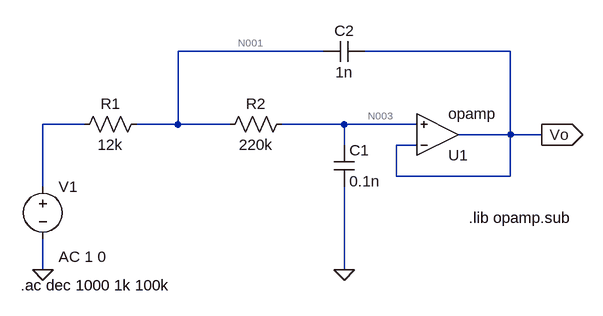
[diagram p0: schematic sallen-key.asc]
sallen-key.asc, the LTspice schematic file:
Version 4
SHEET 1 880 680
WIRE 368 16 144 16
WIRE 656 16 432 16
WIRE 0 128 -64 128
WIRE 144 128 144 16
WIRE 144 128 80 128
WIRE 224 128 144 128
WIRE 400 128 304 128
WIRE 512 128 400 128
WIRE 656 144 656 16
WIRE 656 144 576 144
WIRE 704 144 656 144
WIRE 400 160 400 128
WIRE 512 160 480 160
WIRE 480 208 480 160
WIRE 656 208 656 144
WIRE 656 208 480 208
WIRE -64 224 -64 128
WIRE -64 352 -64 304
WIRE 400 352 400 224
FLAG -64 352 0
FLAG 400 352 0
FLAG 704 144 Vo
IOPIN 704 144 Out
SYMBOL res 96 112 R90
WINDOW 0 0 56 VBottom 2
WINDOW 3 32 56 VTop 2
SYMATTR InstName R1
SYMATTR Value 12k
SYMBOL res 320 112 R90
WINDOW 0 0 56 VBottom 2
WINDOW 3 32 56 VTop 2
SYMATTR InstName R2
SYMATTR Value 220k
SYMBOL cap 384 160 R0
SYMATTR InstName C1
SYMATTR Value 0.1n
SYMBOL cap 432 0 R90
WINDOW 0 0 32 VBottom 2
WINDOW 3 32 32 VTop 2
SYMATTR InstName C2
SYMATTR Value 1n
SYMBOL voltage -64 208 R0
WINDOW 123 24 124 Left 2
WINDOW 39 0 0 Left 0
SYMATTR InstName V1
SYMATTR Value ""
SYMATTR Value2 AC 1 0
SYMBOL OpAmps\\opamp 544 208 M180
SYMATTR InstName U1
TEXT 592 272 Left 2 !.lib opamp.sub
TEXT -98 376 Left 2 !.ac dec 1000 1k 100k

The netlist it stands for:
* sallen-key.asc
R1 N001 N002 12k
R2 N003 N001 220k
C1 N003 0 0.1n
C2 Vo N001 1n
V1 N002 0 AC 1 0
XU1 Vo N003 Vo opamp Aol=100K GBW=10Meg  ; pins invin noninvin out
.lib opamp.sub
.ac dec 1000 1k 100k
.backanno
.end

* Results of the author's LTspice run, read from the files saved beside the schematic
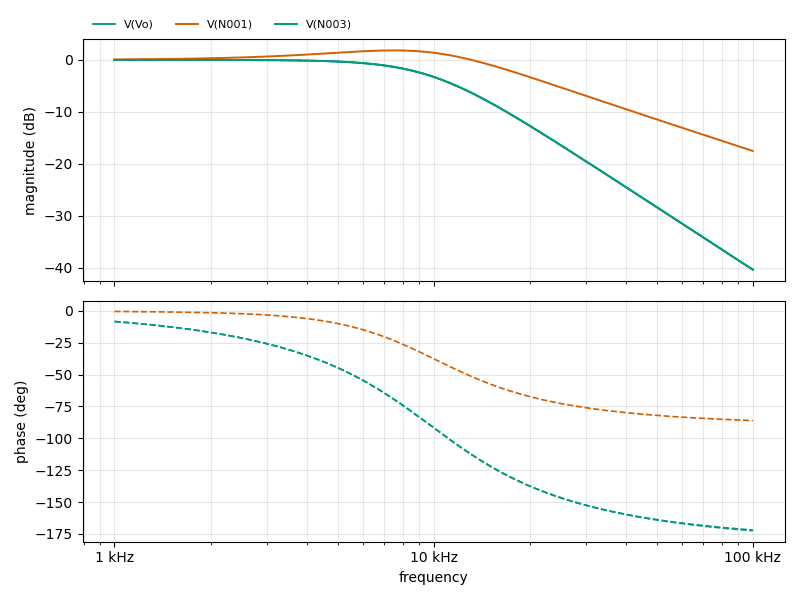
[diagram p1: AC Analysis of sallen-key.asc, plotted from the saved traces]
* AC Analysis, 1 run:
*   V(Vo): -0.00 dB at 1 kHz, -40.37 dB at 100 kHz, peak -0.00 dB at 1 kHz, 3 dB below the peak at 9.703 kHz
*   V(N001): 0.08 dB at 1 kHz, -17.53 dB at 100 kHz, peak 1.81 dB at 7.482 kHz, 3 dB below the peak at 15.49 kHz
*   V(N003): -0.00 dB at 1 kHz, -40.37 dB at 100 kHz, peak -0.00 dB at 1 kHz, 3 dB below the peak at 9.703 kHz